# Altium schematic sheet Top level.SchDoc: Data Logger - Top Level
size A4; DocumentNumber: DL-MB-1; SheetNumber: 1; SheetTotal: 11
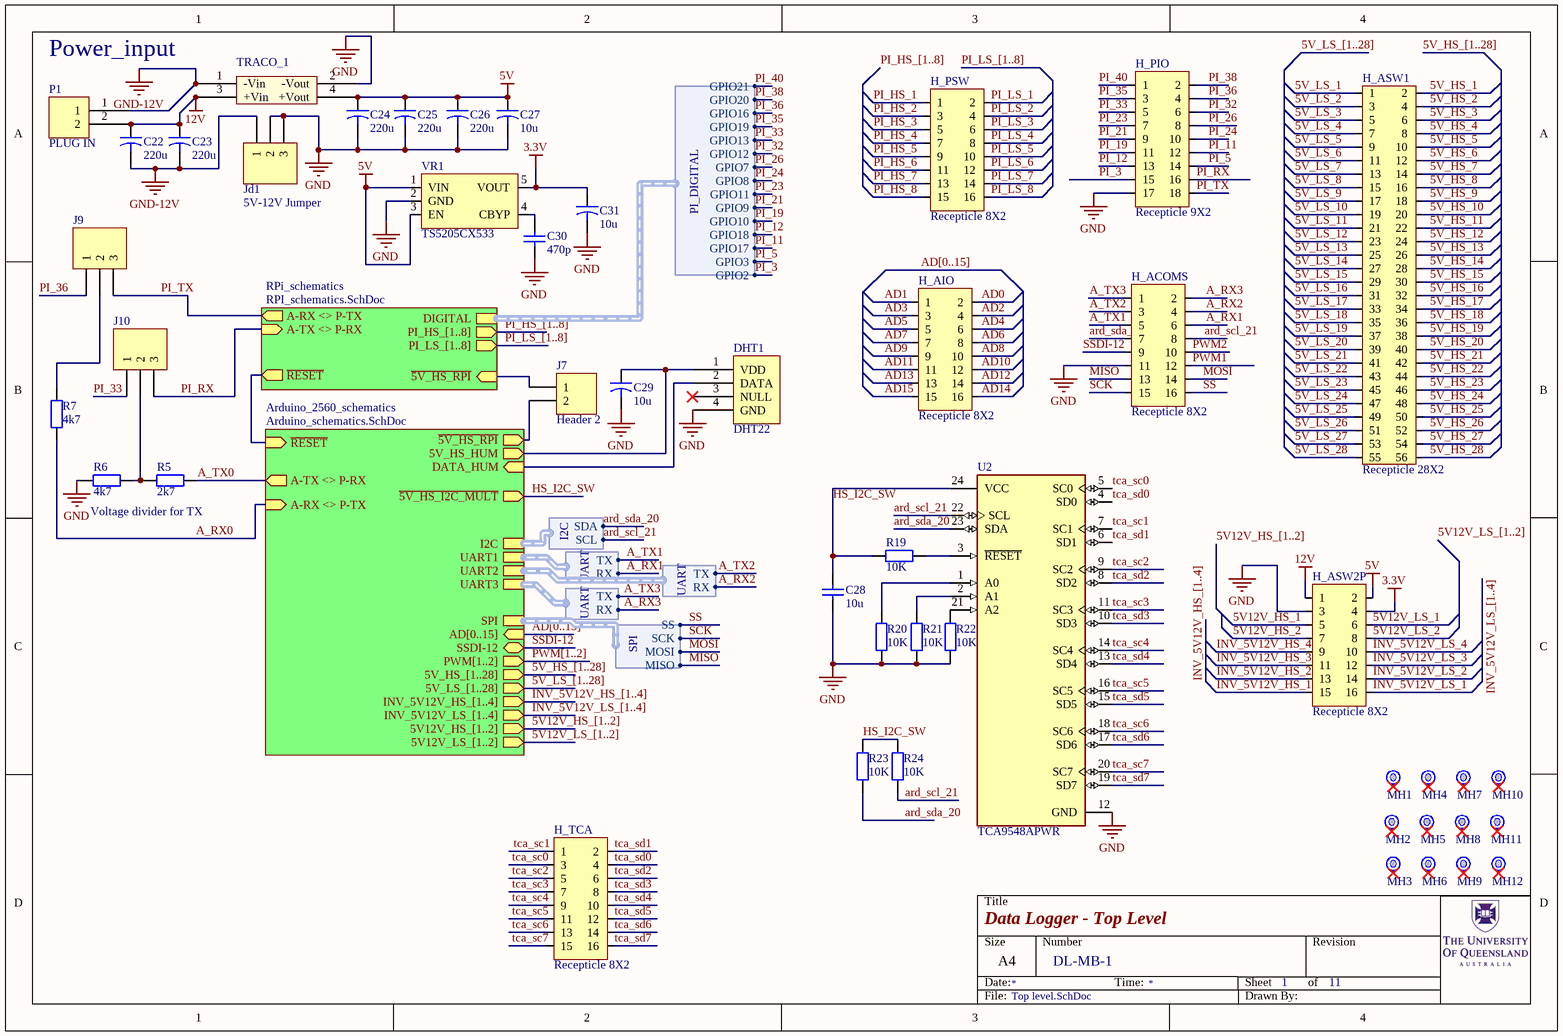
[diagram p0: Top level.SchDoc]

## Parts
C22  220u  [CAPAE9083X80M]
C23  220u  [CAPR5-4X5]
C24  220u  [CAPR5-4X5]
C25  220u  [CAPAE9083X80M]
C26  220u  [CAPR5-4X5]
C27  10u  [CAPR5-4X5]
C28  10u  [RES-1206_M]
C29  10u  [CAPR5-4X5]
C30  470p  [RES-1206_M]
C31  10u  [CAPAE9083X80M]
DHT1  DHT22  [DHT22_HORIZONTAL]
H_ACOMS  Recepticle 8X2  [HDR2X8]
H_AIO  Recepticle 8X2  [HDR2X8]
H_ASW1  Recepticle 28X2  [HDR2X28]
H_ASW2P  Recepticle 8X2  [HDR2X8]
H_PIO  Recepticle 9X2  [HDR2X9]
H_PSW  Recepticle 8X2  [HDR2X8]
H_TCA  Recepticle 8X2  [HDR2X8]
J7  Header 2  [HDR1X2]
J9  Header 3  [HDR1X3]  (value not drawn)
J10  Header 3  [HDR1X3]  (value not drawn)
Jd1  5V-12V Jumper  [HDR1X3]
MH1  MOUNTING_HOLE  [M3]  (value not drawn)
MH2  MOUNTING_HOLE  [M3]  (value not drawn)
MH3  MOUNTING_HOLE  [M3]  (value not drawn)
MH4  MOUNTING_HOLE  [M3]  (value not drawn)
MH5  MOUNTING_HOLE  [M3]  (value not drawn)
MH6  MOUNTING_HOLE  [M3]  (value not drawn)
MH7  MOUNTING_HOLE  [M3]  (value not drawn)
MH8  MOUNTING_HOLE  [M3]  (value not drawn)
MH9  MOUNTING_HOLE  [M3]  (value not drawn)
MH10  MOUNTING_HOLE  [M3]  (value not drawn)
MH11  MOUNTING_HOLE  [M3]  (value not drawn)
MH12  MOUNTING_HOLE  [M3]  (value not drawn)
P1  PLUG IN  [PHOENIX_2PIN]
R5  2k7  [RES-1206_M]
R6  4k7  [RES-1206_M]
R7  4k7  [RES-1206_M]
R19  10K  [RES-1206_M]
R20  10K  [RES-1206_M]
R21  10K  [RES-1206_M]
R22  10K  [RES-1206_M]
R23  10K  [RES-1206_M]
R24  10K  [RES-1206_M]
TRACO_1  TRACO_12vto5.1_151121  [TRACO_12vto5.1_151121]  (value not drawn)
U2  TCA9548APWR  [FP-PW0024A-MFG]
VR1  TS5205CX533  [SOT-25]

## Sub-sheets
Arduino_2560_schematics = Arduino_schematics.SchDoc: ~{5V_HS_RPI} (out), ~{5V_HS_I2C_MULT} (out), DATA_HUM (in), 5V_HS_HUM (out), A-RX <> P-TX (in), A-TX <> P-RX (out), ~{RESET} (in), I2C (harness I2C), SPI (harness SPI), UART1 (harness UART), UART2 (harness UART), UART3 (harness UART), 5V_HS_[1..28] (out), 5V12V_HS_[1..2] (out), AD[0..15] (in), 5V12V_LS_[1..2] (out), INV_5V12V_HS_[1..4] (out), INV_5V12V_LS_[1..4] (out), 5V_LS_[1..28] (out), PWM[1..2] (out), SSDI-12 (bidir)
RPi_schematics = RPI_schematics.SchDoc: ~{5V_HS_RPI} (in), A-TX <> P-RX (in), A-RX <> P-TX (out), ~{RESET} (out), DIGITAL (harness PI_DIGITAL), PI_LS_[1..8] (out), PI_HS_[1..8] (out)

## Harnesses
I2C: SCL, SDA
UART: RX, TX
SPI: MISO, MOSI, SCK, SS
PI_DIGITAL: GPIO2, GPIO3, GPIO17, GPIO18, GPIO10, GPIO9, GPIO11, GPIO8, GPIO7, GPIO12, GPIO13, GPIO19, GPIO16, GPIO20, GPIO21

## Nets
3.3V: C31.1 H_ASW2P.4 VR1.5(VOUT)
5V: C24.1 C25.1 C26.1 C27.1 H_ASW2P.2 TRACO_1.4(+Vout) VR1.1(VIN) VR1.3(EN)
12V: C22.1 C23.1 H_ASW2P.1 P1.2 TRACO_1.3(+Vin)
GND: C24.2 C25.2 C26.2 C27.2 C28.2 C29.2 C30.2 C31.2 DHT1.4(GND) H_ACOMS.11 H_ASW2P.3 H_PIO.17 Jd1.2 Jd1.3 R6.2 R20.2 R21.2 R22.2 TRACO_1.2(-Vout) U2.12(GND) VR1.2(GND)
GND-12V: C22.2 C23.2 Jd1.1 P1.1 TRACO_1.1(-Vin)
5V12V_HS_1: H_ASW2P.5
5V12V_HS_2: H_ASW2P.7
5V12V_LS_1: H_ASW2P.6
5V12V_LS_2: H_ASW2P.8
5V_HS_1: H_ASW1.2
5V_HS_2: H_ASW1.4
5V_HS_3: H_ASW1.6
5V_HS_4: H_ASW1.8
5V_HS_5: H_ASW1.10
5V_HS_6: H_ASW1.12
5V_HS_7: H_ASW1.14
5V_HS_8: H_ASW1.16
5V_HS_9: H_ASW1.18
5V_HS_10: H_ASW1.20
5V_HS_11: H_ASW1.22
5V_HS_12: H_ASW1.24
5V_HS_13: H_ASW1.26
5V_HS_14: H_ASW1.28
5V_HS_15: H_ASW1.30
5V_HS_16: H_ASW1.32
5V_HS_17: H_ASW1.34
5V_HS_18: H_ASW1.36
5V_HS_19: H_ASW1.38
5V_HS_20: H_ASW1.40
5V_HS_21: H_ASW1.42
5V_HS_22: H_ASW1.44
5V_HS_23: H_ASW1.46
5V_HS_24: H_ASW1.48
5V_HS_25: H_ASW1.50
5V_HS_26: H_ASW1.52
5V_HS_27: H_ASW1.54
5V_HS_28: H_ASW1.56
5V_LS_1: H_ASW1.1
5V_LS_2: H_ASW1.3
5V_LS_3: H_ASW1.5
5V_LS_4: H_ASW1.7
5V_LS_5: H_ASW1.9
5V_LS_6: H_ASW1.11
5V_LS_7: H_ASW1.13
5V_LS_8: H_ASW1.15
5V_LS_9: H_ASW1.17
5V_LS_10: H_ASW1.19
5V_LS_11: H_ASW1.21
5V_LS_12: H_ASW1.23
5V_LS_13: H_ASW1.25
5V_LS_14: H_ASW1.27
5V_LS_15: H_ASW1.29
5V_LS_16: H_ASW1.31
5V_LS_17: H_ASW1.33
5V_LS_18: H_ASW1.35
5V_LS_19: H_ASW1.37
5V_LS_20: H_ASW1.39
5V_LS_21: H_ASW1.41
5V_LS_22: H_ASW1.43
5V_LS_23: H_ASW1.45
5V_LS_24: H_ASW1.47
5V_LS_25: H_ASW1.49
5V_LS_26: H_ASW1.51
5V_LS_27: H_ASW1.53
5V_LS_28: H_ASW1.55
A_RX0: R7.2 ; sheet Arduino_2560_schematics/A-RX <> P-TX
A_RX1: H_ACOMS.6 ; sheet Arduino_2560_schematics/UART1.RX
A_RX2: H_ACOMS.4 ; sheet Arduino_2560_schematics/UART2.RX
A_RX3: H_ACOMS.2 ; sheet Arduino_2560_schematics/UART3.RX
A_TX0: R5.1 ; sheet Arduino_2560_schematics/A-TX <> P-RX
A_TX1: H_ACOMS.5 ; sheet Arduino_2560_schematics/UART1.TX
A_TX2: H_ACOMS.3 ; sheet Arduino_2560_schematics/UART2.TX
A_TX3: H_ACOMS.1 ; sheet Arduino_2560_schematics/UART3.TX
AD0: H_AIO.2
AD1: H_AIO.1
AD2: H_AIO.4
AD3: H_AIO.3
AD4: H_AIO.6
AD5: H_AIO.5
AD6: H_AIO.8
AD7: H_AIO.7
AD8: H_AIO.10
AD9: H_AIO.9
AD10: H_AIO.12
AD11: H_AIO.11
AD12: H_AIO.14
AD13: H_AIO.13
AD14: H_AIO.16
AD15: H_AIO.15
ard_scl_21: H_ACOMS.8 R24.2 U2.22(SCL) ; sheet Arduino_2560_schematics/I2C.SCL
ard_sda_20: H_ACOMS.7 R23.2 U2.23(SDA) ; sheet Arduino_2560_schematics/I2C.SDA
HS_I2C_SW: C28.1 R19.1 R23.1 R24.1 U2.24(VCC) ; sheet Arduino_2560_schematics/~{5V_HS_I2C_MULT}
INV_5V12V_HS_1: H_ASW2P.15
INV_5V12V_HS_2: H_ASW2P.13
INV_5V12V_HS_3: H_ASW2P.11
INV_5V12V_HS_4: H_ASW2P.9
INV_5V12V_LS_1: H_ASW2P.16
INV_5V12V_LS_2: H_ASW2P.14
INV_5V12V_LS_3: H_ASW2P.12
INV_5V12V_LS_4: H_ASW2P.10
MISO: H_ACOMS.13 ; sheet Arduino_2560_schematics/SPI.MISO
MOSI: H_ACOMS.14 ; sheet Arduino_2560_schematics/SPI.MOSI
PI_3: H_PIO.15 ; sheet RPi_schematics/DIGITAL.GPIO2
PI_5: H_PIO.14 ; sheet RPi_schematics/DIGITAL.GPIO3
PI_11: H_PIO.12 ; sheet RPi_schematics/DIGITAL.GPIO17
PI_12: H_PIO.13 ; sheet RPi_schematics/DIGITAL.GPIO18
PI_19: H_PIO.11 ; sheet RPi_schematics/DIGITAL.GPIO10
PI_21: H_PIO.9 ; sheet RPi_schematics/DIGITAL.GPIO9
PI_23: H_PIO.7 ; sheet RPi_schematics/DIGITAL.GPIO11
PI_24: H_PIO.10 ; sheet RPi_schematics/DIGITAL.GPIO8
PI_26: H_PIO.8 ; sheet RPi_schematics/DIGITAL.GPIO7
PI_32: H_PIO.6 ; sheet RPi_schematics/DIGITAL.GPIO12
PI_33: H_PIO.5 J10.1 ; sheet RPi_schematics/DIGITAL.GPIO13
PI_35: H_PIO.3 ; sheet RPi_schematics/DIGITAL.GPIO19
PI_36: H_PIO.4 J9.1 ; sheet RPi_schematics/DIGITAL.GPIO16
PI_38: H_PIO.2 ; sheet RPi_schematics/DIGITAL.GPIO20
PI_40: H_PIO.1 ; sheet RPi_schematics/DIGITAL.GPIO21
PI_HS_1: H_PSW.1
PI_HS_2: H_PSW.3
PI_HS_3: H_PSW.5
PI_HS_4: H_PSW.7
PI_HS_5: H_PSW.9
PI_HS_6: H_PSW.11
PI_HS_7: H_PSW.13
PI_HS_8: H_PSW.15
PI_LS_1: H_PSW.2
PI_LS_2: H_PSW.4
PI_LS_3: H_PSW.6
PI_LS_4: H_PSW.8
PI_LS_5: H_PSW.10
PI_LS_6: H_PSW.12
PI_LS_7: H_PSW.14
PI_LS_8: H_PSW.16
PI_RX: H_PIO.16 J10.3 ; sheet RPi_schematics/A-TX <> P-RX
PI_TX: H_PIO.18 J9.3 ; sheet RPi_schematics/A-RX <> P-TX
PWM1: H_ACOMS.12
PWM2: H_ACOMS.10
SCK: H_ACOMS.15 ; sheet Arduino_2560_schematics/SPI.SCK
SS: H_ACOMS.16 ; sheet Arduino_2560_schematics/SPI.SS
SSDI-12: H_ACOMS.9 ; sheet Arduino_2560_schematics/SSDI-12
tca_sc0: H_TCA.3 U2.5(SC0)
tca_sc1: H_TCA.1 U2.7(SC1)
tca_sc2: H_TCA.5 U2.9(SC2)
tca_sc3: H_TCA.7 U2.11(SC3)
tca_sc4: H_TCA.9 U2.14(SC4)
tca_sc5: H_TCA.11 U2.16(SC5)
tca_sc6: H_TCA.13 U2.18(SC6)
tca_sc7: H_TCA.15 U2.20(SC7)
tca_sd0: H_TCA.4 U2.4(SD0)
tca_sd1: H_TCA.2 U2.6(SD1)
tca_sd2: H_TCA.6 U2.8(SD2)
tca_sd3: H_TCA.8 U2.10(SD3)
tca_sd4: H_TCA.10 U2.13(SD4)
tca_sd5: H_TCA.12 U2.15(SD5)
tca_sd6: H_TCA.14 U2.17(SD6)
tca_sd7: H_TCA.16 U2.19(SD7)
NetC29_1: C29.1 DHT1.1(VDD) ; sheet Arduino_2560_schematics/5V_HS_HUM
NetC30_1: C30.1 VR1.4(CBYP)
NetDHT1_2: DHT1.2(DATA) ; sheet Arduino_2560_schematics/DATA_HUM
NetJ7_1: J7.1 ; sheet RPi_schematics/~{5V_HS_RPI}
NetJ7_2: J7.2 ; sheet Arduino_2560_schematics/~{5V_HS_RPI}
NetJ9_2: J9.2 R7.1
NetJ10_2: J10.2 R5.2 R6.1
NetR19_2: R19.2 U2.3(~{RESET})
NetR20_1: R20.1 U2.1(A0)
NetR21_1: R21.1 U2.2(A1)
NetR22_1: R22.1 U2.21(A2)
(unnamed): sheet RPi_schematics/~{RESET}, sheet Arduino_2560_schematics/~{RESET}

Not connected (* = marked no-connect by the designer): DHT1 3(NULL)*; MH1 0*; MH2 0*; MH3 0*; MH4 0*; MH5 0*; MH6 0*; MH7 0*; MH8 0*; MH9 0*; MH10 0*; MH11 0*; MH12 0*

## Buses and harness runs
bus 5V12V_HS_[1..2]
bus 5V12V_HS_[1..2] = sheet Arduino_2560_schematics/5V12V_HS_[1..2]
bus 5V12V_LS_[1..2]
bus 5V12V_LS_[1..2] = sheet Arduino_2560_schematics/5V12V_LS_[1..2]
bus 5V_HS_[1..28]
bus 5V_HS_[1..28] = sheet Arduino_2560_schematics/5V_HS_[1..28]
bus 5V_LS_[1..28]
bus 5V_LS_[1..28] = sheet Arduino_2560_schematics/5V_LS_[1..28]
bus AD[0..15]
bus AD[0..15] = sheet Arduino_2560_schematics/AD[0..15]
bus INV_5V12V_HS_[1..4]
bus INV_5V12V_HS_[1..4] = sheet Arduino_2560_schematics/INV_5V12V_HS_[1..4]
bus INV_5V12V_LS_[1..4]
bus INV_5V12V_LS_[1..4] = sheet Arduino_2560_schematics/INV_5V12V_LS_[1..4]
bus PI_HS_[1..8]
bus PI_HS_[1..8] = sheet RPi_schematics/PI_HS_[1..8]
bus PI_LS_[1..8]
bus PI_LS_[1..8] = sheet RPi_schematics/PI_LS_[1..8]
bus PWM[1..2] = sheet Arduino_2560_schematics/PWM[1..2]

## Notes on the sheet
- Power_input
- Voltage divider for TX
- Title
- Size
- Date:
- A4
- Number
- Time:
- Sheet
- of
- Revision
- File:
- Drawn By:

## Library data of the parts
C22-C27 C29 C31 = Cap Pol1: Capacitor; Publisher: Altium Limited; PackageDescription: Polarized Capacitor; 2 Leads
  C22 C25: Published: 23-Sep-2002; Value: 220u
  C23 C24 C26: Published: 23-Sep-02; Value: 220u; Link: https://au.rs-online.com/web/p/aluminium-capacitors/1918277/
  C27 C29: Published: 23-Sep-02; Value: 10u; Link: https://au.rs-online.com/web/p/aluminium-capacitors/2244325/
  C31: Published: 23-Sep-02; Value: 10u
C28 C30 = Cap Semi: Capacitor (Semiconductor SIM Model); Published: 8-Jun-2000; Publisher: Altium Limited; PackageDescription: Chip Capacitor; LatestRevisionDate: 29-May-2009; LatestRevisionNote: IPC-7351 Footprint Added.
  C28: PackageReference: C0805; Value: 10u
  C30: PackageReference: C1206; Value: 470p
H_ACOMS H_AIO H_ASW2P H_PSW H_TCA = Header 8X2: Header, 8-Pin, Dual row; System: Connector; LatestRevisionDate: 17-Jul-2002; LatestRevisionNote: Re-released for DXP Platform.; Publisher: Altium Limited
H_ASW1 = Header 28X2: Header, 28-Pin, Dual row; System: Connector; LatestRevisionDate: 17-Jul-2002; LatestRevisionNote: Re-released for DXP Platform.; Publisher: Altium Limited
H_PIO = Header 9X2: Header, 9-Pin, Dual row; System: Connector; LatestRevisionDate: 17-Jul-2002; LatestRevisionNote: Re-released for DXP Platform.; Publisher: Altium Limited
J7 = Header 2: Header, 2-Pin / Arduino->RPI Power; LatestRevisionDate: 17-Jul-2002; LatestRevisionNote: Re-released for DXP Platform.; Publisher: Altium Limited
J9 J10 = Header 3: Header, 3-Pin; LatestRevisionDate: 17-Jul-2002; LatestRevisionNote: Re-released for DXP Platform.; Publisher: Altium Limited
Jd1 = Header 3: 12V and 5v Tie in Ground; LatestRevisionDate: 17-Jul-2002; LatestRevisionNote: Re-released for DXP Platform.; Publisher: Altium Limited
MH1-MH12 = MOUNTING_HOLE: M3 Mounting Hole
P1 = Phoenix_2pin
R5-R7 R19-R24 = Res2: Resistor; Published: 8-Jun-2000; LatestRevisionDate: 17-Jul-2002; LatestRevisionNote: Re-released for DXP Platform.; PackageReference: 1206; Publisher: Altium Limited; PackageDescription: Chip Resistor 1206 Case Size
  R5: Value: 2k7
  R6 R7: Value: 4k7
  R19-R24: Value: 10K
TRACO_1 = TRACO_12vto5.1_151121: TRACOPOWER TEL 15 15W Isolated DC-DC Converter Through Hole, Voltage in 9 → 18 V dc, Voltage out 5.1V dc; Link: https://au.rs-online.com/web/p/isolated-dc-dc-converters/1665605/; Supplier 1: Mouser; Supplier 2: RSComponents; Supplier 3: RSComponents; Supplier 4: RSComponents; Supplier Part Number 1: 495-TEL-15-1211; Supplier Part Number 2: 5106046; Supplier Part Number 3: 5106046P; Supplier Part Number 4: 1665605
U2 = CMP-04892-000002-1: IC I2C SW 8CH W/RESET 24TSSOP; Manufacturer: Texas Instruments; Number Of Circuits: 1; Mux Demux Ratio: 1:8; Nominal Supply Current: 2-50uA; Interface: I2C,SMBus; Min Supply Voltage: 1.65V; Standoff Height: 0.05mm; Max Supply Voltage: 5.5V; Device Class L2: Interface ICs; ComponentLink2Description: Datasheet; Ipc Land Pattern Name: SOP65P640X120-24; Category: IC; Device Class L1: Integrated Circuits (ICs); Manufacturer Part Number: TCA9548APWR; RoHS: TRUE; Temperature Range High: +85°C; Digikey Description: IC I2C SW 8CH W/RESET 24TSSOP; Temperature Range Low: -40°C; Lead Free: Yes; Package: PW0024A; ComponentLink2URL: http://www.ti.com/lit/ds/symlink/tca9548a.pdf; Device Class L3: Multiplexers; Ambient Temperature Range Low: -40°C; Mouser Description: Low-Voltage 8-Channel I2C Switch With Reset 24-TSSOP -40 to 85; Temperature: -40°C to +85°C; Octopart: https://octopart.com/tca9548apwr-texas+instruments-22266789; Ambient Temperature Range High: +85°C; Automotive: No; Height: 1.2mm
VR1 = TS5205: 150mA Low Noise LDO Voltage Regulator with Enable Function; PackageReference: SOT-25